# Altium schematic sheet Sheet2.SchDoc
size A4; SheetNumber: 2; SheetTotal: 2
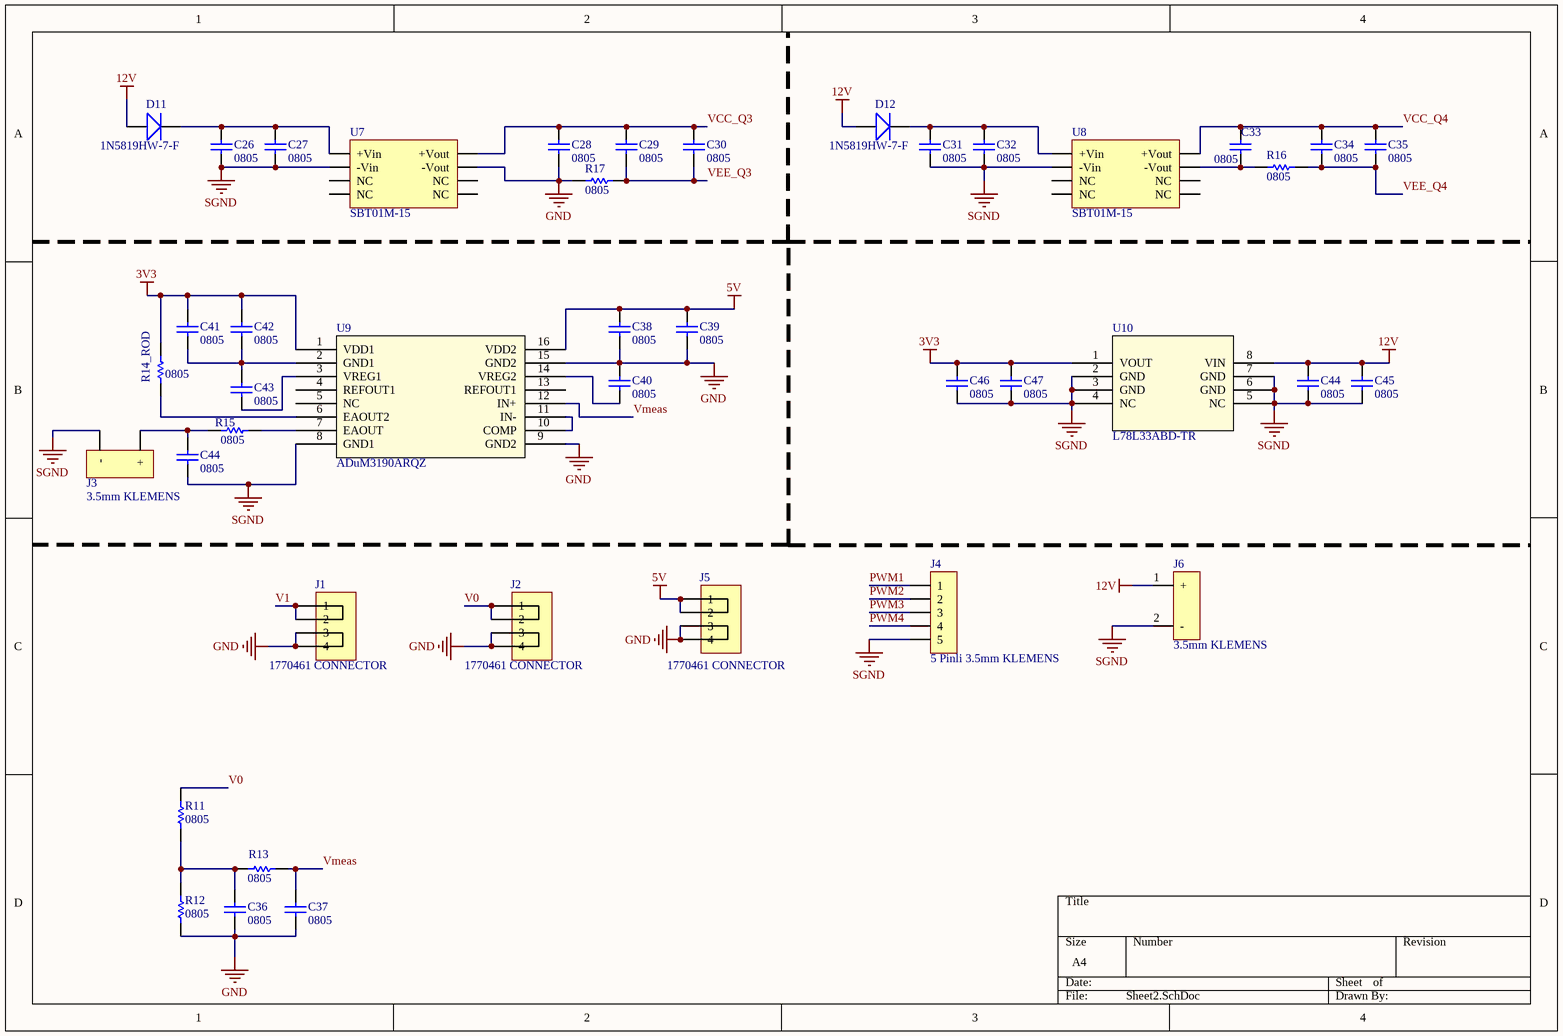
[diagram p0: Sheet2.SchDoc]

## Parts
(Parts that share a designator on the sheet are numbered #1, #2 ... from top to bottom, then left to right.)
C26  0805  [0805 CAPACITOR]
C27  0805  [0805 CAPACITOR]
C28  0805  [0805 CAPACITOR]
C29  0805  [0805 CAPACITOR]
C30  0805  [0805 CAPACITOR]
C31  0805  [0805 CAPACITOR]
C32  0805  [0805 CAPACITOR]
C33  0805  [0805 CAPACITOR]
C34  0805  [0805 CAPACITOR]
C35  0805  [0805 CAPACITOR]
C36  0805  [0805 CAPACITOR]
C37  0805  [0805 CAPACITOR]
C38  0805  [0805 CAPACITOR]
C39  0805  [0805 CAPACITOR]
C40  0805  [0805 CAPACITOR]
C41  0805  [0805 CAPACITOR]
C42  0805  [0805 CAPACITOR]
C43  0805  [0805 CAPACITOR]
C44#1  0805  [0805 CAPACITOR]
C44#2  0805  [0805 CAPACITOR]
C45  0805  [0805 CAPACITOR]
C46  0805  [0805 CAPACITOR]
C47  0805  [0805 CAPACITOR]
D11  1N5819HW-7-F  [1N5819HW-7-F_DIO-M]
D12  1N5819HW-7-F  [1N5819HW-7-F_DIO-M]
J1  1770461 CONNECTOR  [CONN_1770461]
J2  1770461 CONNECTOR  [CONN_1770461]
J3  3.5mm KLEMENS  [3PIN 3.5mm KLEMENS]
J4  5 Pinli 3.5mm KLEMENS  [5PIN 35.MM KLEMENS]
J5  1770461 CONNECTOR  [CONN_1770461]
J6  3.5mm KLEMENS  [3PIN 3.5mm KLEMENS]
R11  0805  [0805 RESISTOR]
R12  0805  [0805 RESISTOR]
R13  0805  [0805 RESISTOR]
R14_ROD  0805  [0805 RESISTOR]
R15  0805  [0805 RESISTOR]
R16  0805  [0805 RESISTOR]
R17  0805  [0805 RESISTOR]
U7  SBT01M-15  [SBT01M-15]
U8  SBT01M-15  [SBT01M-15]
U9  ADuM3190ARQZ  [ADuM3190ARQZ]
U10  L78L33ABD-TR  [L78L33ABD-TR]

## Nets
3V3: C41.2 C42.2 C46.2 C47.2 R14_ROD.2 U9.1(VDD1) U10.1(VOUT)
5V: C38.2 C39.2 J5.1 J5.2 U9.16(VDD2)
12V: C44#1.2 C45.2 D11.1 D12.1 J6.1(+) U10.8(VIN)
GND: C28.1 C36.1 C37.1 C38.1 C39.1 C40.2 J1.3 J1.4 J2.3 J2.4 J5.3 J5.4 R12.2 R17.1 U7.4(-Vout) U9.9(GND2) U9.15(GND2)
SGND: C26.2 C27.1 C31.1 C32.1 C44#1.1 C44#2.1 C45.1 C46.1 C47.1 J3.2(-) J4.5 J6.2(-) U7.1(-Vin) U8.1(-Vin) U9.8(GND1) U10.2(GND) U10.3(GND) U10.4(NC) U10.5(NC) U10.6(GND) U10.7(GND)
PWM1: J4.1
PWM2: J4.2
PWM3: J4.3
PWM4: J4.4
V0: J2.1 J2.2 R11.1
V1: J1.1 J1.2
VCC_Q3: C28.2 C29.2 C30.2 U7.5(+Vout)
VCC_Q4: C33.2 C34.2 C35.2 U8.5(+Vout)
VEE_Q3: C29.1 C30.1 R17.2
VEE_Q4: C34.1 C35.1 R16.2
Vmeas: C37.2 R13.1 U9.12(IN+)
NetC26_1: C26.1 C27.2 D11.2 U7.2(+Vin)
NetC31_2: C31.2 C32.2 D12.2 U8.2(+Vin)
NetC33_1: C33.1 R16.1 U8.4(-Vout)
NetC36_2: C36.2 R11.2 R12.1 R13.2
NetC40_1: C40.1 U9.14(VREG2)
NetC41_1: C41.1 C42.1 C43.2 U9.2(GND1)
NetC43_1: C43.1 U9.3(VREG1)
NetC44#2_2: C44#2.2 J3.1(+) R15.1
NetR14_ROD_1: R14_ROD.1 U9.6(EAOUT2)
NetR15_2: R15.2 U9.7(EAOUT)
NetU9_10: U9.10(COMP) U9.11(IN-)

Not connected (* = marked no-connect by the designer): U7 3(NC) 6(NC) 7(NC) 8(NC); U8 3(NC) 6(NC) 7(NC) 8(NC); U9 4(REFOUT1) 5(NC) 13(REFOUT1)

## Library data of the parts
C26-C37 = 0805 CAPACITANCE: 4.7UF 100V CAP CER  X7S 0805
C38-C43 C44#1 C44#2 C45-C47 = 0805CAP_1: 0.1UF 100V CAP CER X5R 0402
D11 D12 = 1N5819HW-7-F: 40V 1A DIODE SCHOTTKY
J1 J2 J5 = 1770461 CONNECTOR: TERM BLK 2P SIDE ENTRY
R11-R13 R14_ROD R15-R17 = 0805 RESISTOR: 1K OHM 16V
U9 = ADuM3190ARQZ: IC ISOLATOR 16QSOP
U10 = L78L33ABD-TR: IC REG LINEAR 3.3V 100MA 8SO